# Altium schematic sheet Acorn_AudioHybrid.SchDoc: ARM2 to ARM3 Adapter
size A3; DocumentNumber: 1; SheetNumber: 1; SheetTotal: 1
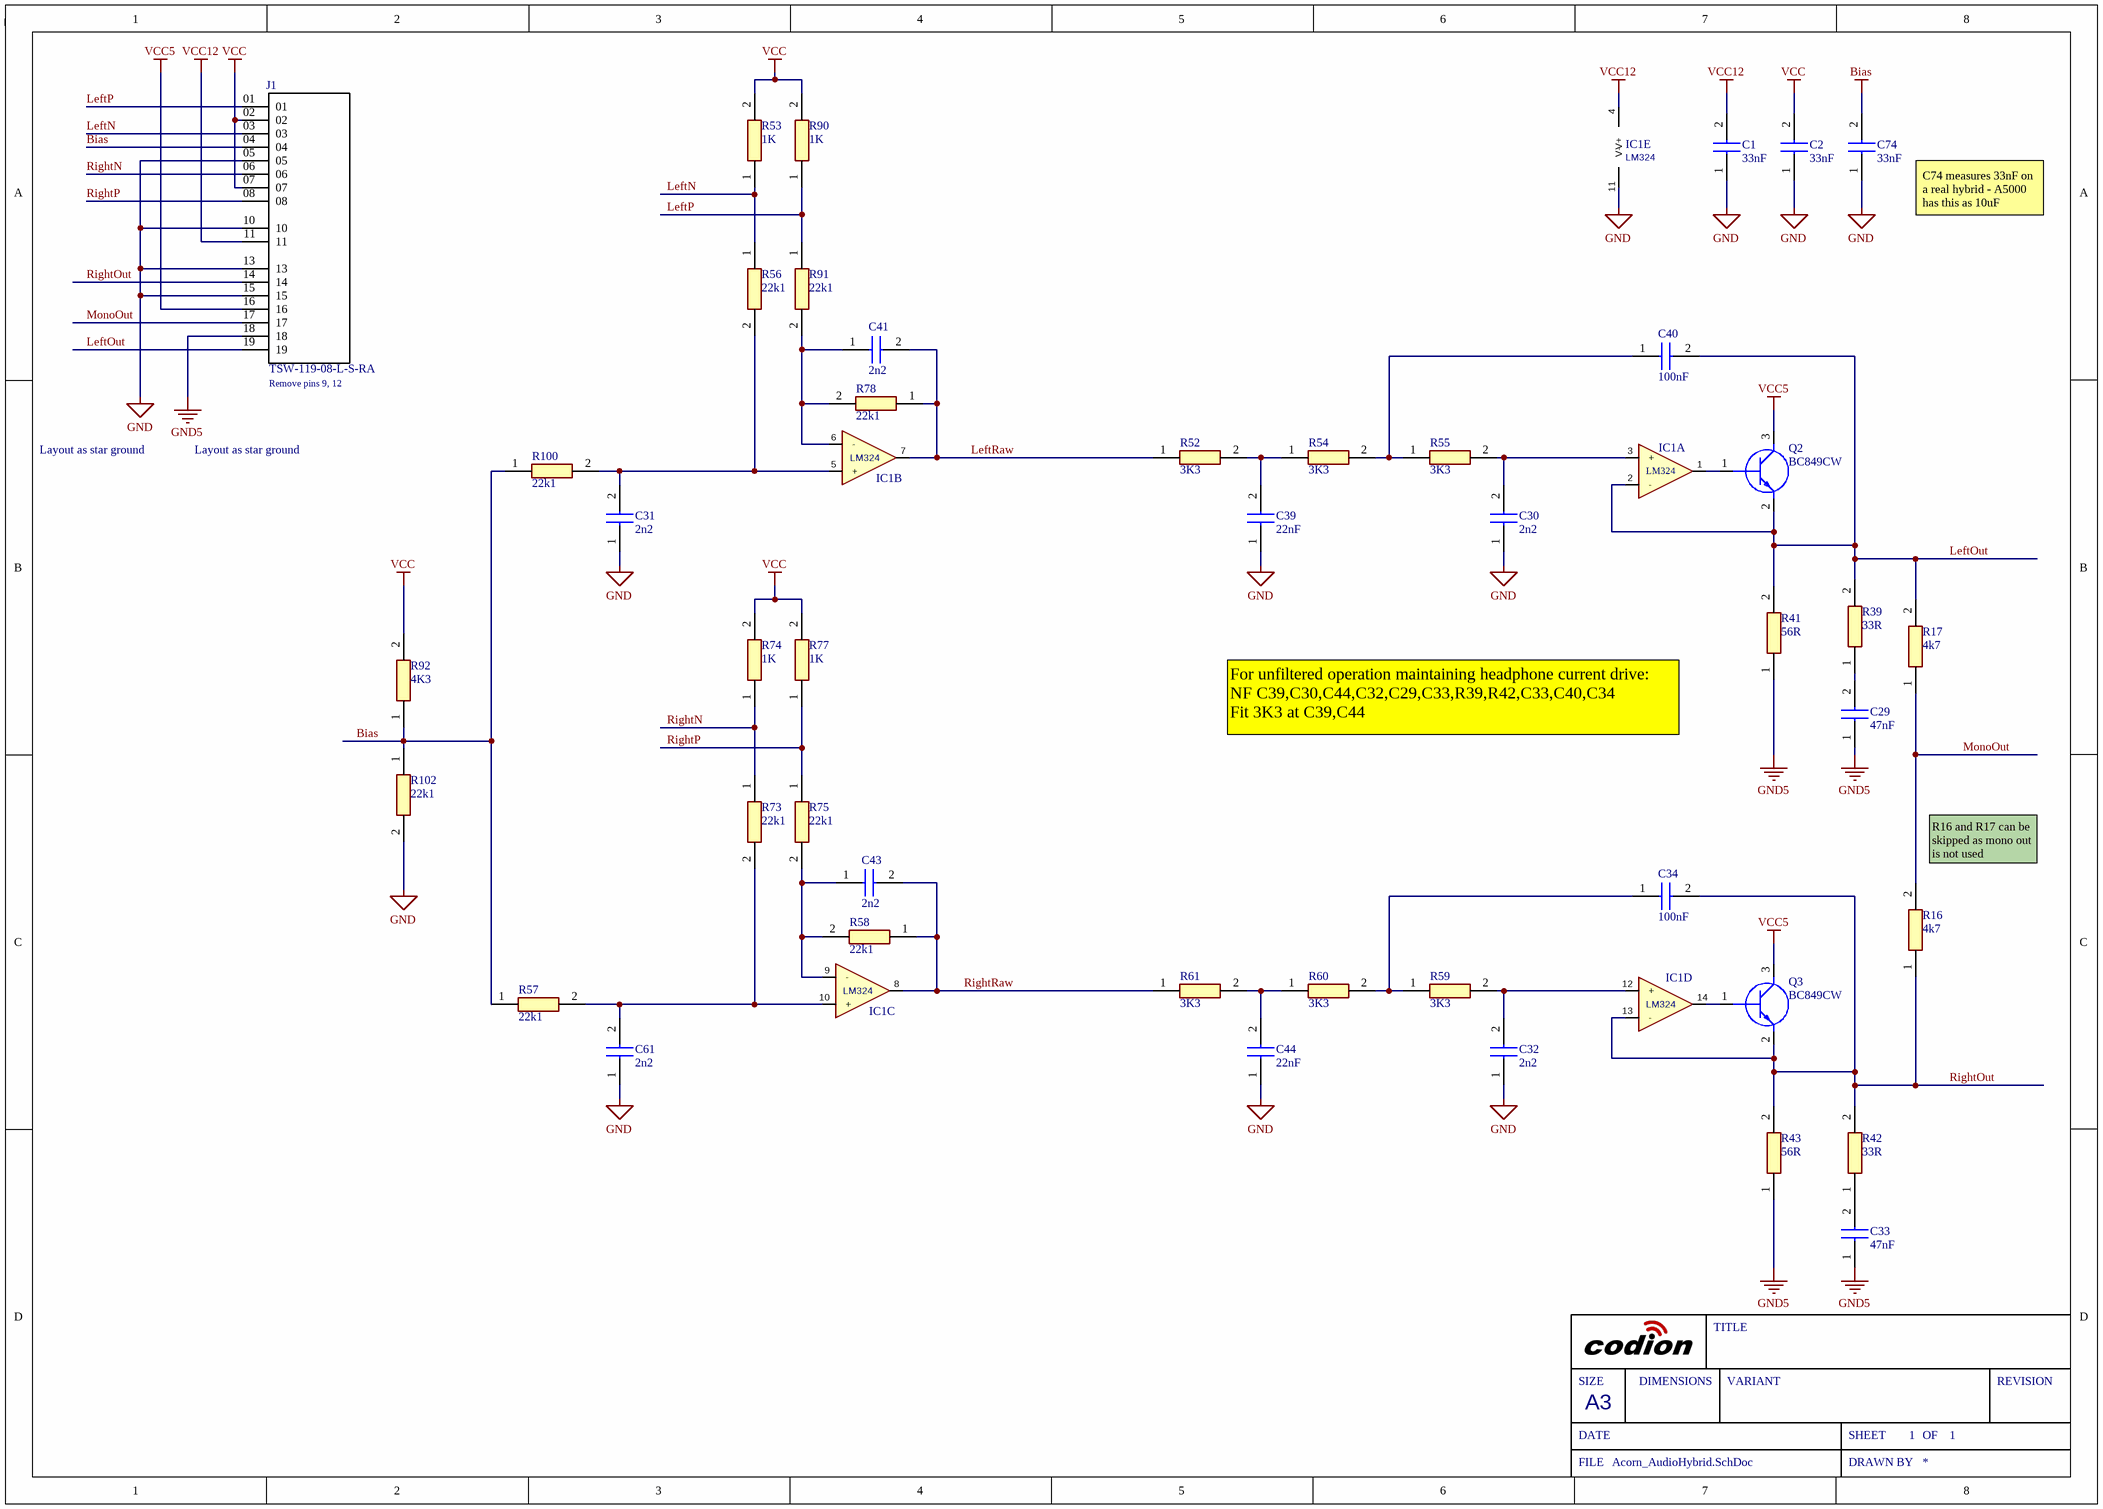
[diagram p0: Acorn_AudioHybrid.SchDoc]

## Parts
C1  33nF  [CAPC2012X145N]
C2  33nF  [CAPC2012X145N]
C29  47nF  [C0402C104J4RACTU]
C30  2n2  [CAPC1005X55N]
C31  2n2  [CAPC1005X55N]
C32  2n2  [CAPC1005X55N]
C33  47nF  [C0402C104J4RACTU]
C34  100nF  [CAPC1005X55N]
C39  22nF  [C0402]
C40  100nF  [CAPC1005X55N]
C41  2n2  [CAPC1005X55N]
C43  2n2  [CAPC1005X55N]
C44  22nF  [C0402]
C61  2n2  [CAPC1005X55N]
C74  33nF  [CAPC2012X145N]
IC1  value LM324  [SOIC127P600X180-14N]  (hidden comment: LM324M)  (parts A,B,C,D,E of 5)
J1  TSW-119-08-L-S-RA  [*SAMTEC_TSW-119-08-L-S-RA_TSW-119-08-L-S-RA(Primary)]
Q2  BC849CW  [SOT65P210X110-3N]
Q3  BC849CW  [SOT65P210X110-3N]
R16  4k7  [RESC1005X40N]
R17  4k7  [RESC1005X40N]
R39  33R  [RESC1005X40N]
R41  56R  [CRCW0402200KFKED]
R42  33R  [RESC1005X40N]
R43  56R  [CRCW0402200KFKED]
R52  3K3  [CRCW0402200KFKED]
R53  1K  [RESC1005X40N]
R54  3K3  [CRCW0402200KFKED]
R55  3K3  [CRCW0402200KFKED]
R56  22k1  [RESC1005X40N]
R57  22k1  [RESC1005X40N]
R58  22k1  [RESC1005X40N]
R59  3K3  [CRCW0402200KFKED]
R60  3K3  [CRCW0402200KFKED]
R61  3K3  [CRCW0402200KFKED]
R73  22k1  [RESC1005X40N]
R74  1K  [RESC1005X40N]
R75  22k1  [RESC1005X40N]
R77  1K  [RESC1005X40N]
R78  22k1  [RESC1005X40N]
R90  1K  [RESC1005X40N]
R91  22k1  [RESC1005X40N]
R92  4K3  [RESC1005X40N]
R100  22k1  [RESC1005X40N]
R102  22k1  [RESC1005X40N]

## Nets
Bias: C74.2 J1.04 R57.1 R92.1 R100.1 R102.1
GND: C1.1 C2.1 C30.1 C31.1 C32.1 C39.1 C44.1 C61.1 C74.1 IC1.11(V-) J1.05 J1.10 J1.13 J1.15 R102.2
GND5: C29.1 C33.1 J1.18 R41.1 R43.1
VCC: C2.2 J1.02 J1.07 R53.2 R74.2 R77.2 R90.2 R92.2
VCC5: J1.16 Q2.3(C) Q3.3(C)
VCC12: C1.2 IC1.4(V+) J1.11
LeftN: J1.03 R53.1 R56.1
LeftOut: C40.2 IC1.2(-) J1.19 Q2.2(E) R17.2 R39.2 R41.2
LeftP: J1.01 R90.1 R91.1
LeftRaw: C41.2 IC1.7 R52.1 R78.1
MonoOut: J1.17 R16.2 R17.1
RightN: J1.06 R73.1 R74.1
RightOut: C34.2 IC1.13(-) J1.14 Q3.2(E) R16.1 R42.2 R43.2
RightP: J1.08 R75.1 R77.1
RightRaw: C43.2 IC1.8 R58.1 R61.1
NetC29_2: C29.2 R39.1
NetC30_2: C30.2 IC1.3(+) R55.2
NetC31_2: C31.2 IC1.5(+) R56.2 R100.2
NetC32_2: C32.2 IC1.12(+) R59.2
NetC33_2: C33.2 R42.1
NetC34_1: C34.1 R59.1 R60.2
NetC39_2: C39.2 R52.2 R54.1
NetC40_1: C40.1 R54.2 R55.1
NetC41_1: C41.1 IC1.6(-) R78.2 R91.2
NetC43_1: C43.1 IC1.9(-) R58.2 R75.2
NetC44_2: C44.2 R60.1 R61.2
NetC61_2: C61.2 IC1.10(+) R57.2 R73.2
NetIC1_1: IC1.1 Q2.1(B)
NetIC1_14: IC1.14 Q3.1(B)

## Notes on the sheet
- C74 measures 33nF on a real hybrid - A5000 has this as 10uF
- Layout as star ground
- (near J1) Remove pins 9, 12
- For unfiltered operation maintaining headphone current drive:
  NF C39,C30,C44,C32,C29,C33,R39,R42,C33,C40,C34
  Fit 3K3 at C39,C44
- (near R16) R16 and R17 can be skipped as mono out is not used
- SIZE
- DIMENSIONS
- TITLE
- VARIANT
- REVISION
- DATE
- A3
- SHEET
- OF
- FILE
- DRAWN BY

## Library data of the parts
C1 C2 C74 = C2012C0G1H333J125AA: Capacitor; Manufacturer_Name: TDK; Datasheet Link: https://product.tdk.com/info/en/catalog/datasheets/mlcc_commercial_midvoltage_en.pdf; Height: 1.45mm; Manufacturer_Part_Number: C2012C0G1H333J125AA; Mouser Part Number: 810-C2012C0G1H333J; Mouser Price/Stock: https://www.mouser.co.uk/ProductDetail/TDK/C2012C0G1H333J125AA?qs=NRhsANhppD%252B9iusLcop9UA%3D%3D; Arrow Part Number: C2012C0G1H333J125AA; Arrow Price/Stock: https://www.arrow.com/en/products/c2012c0g1h333j125aa/tdk
C29 C33 = C0402C473K3RECTU: Capacitor; Manufacturer_Name: Yageo Group; Datasheet Link: https://content.kemet.com/datasheets/KEM_C1002_X7R_SMD.pdf; Height: 0.55mm; Manufacturer_Part_Number: C0402C473K3RECTU; Mouser Part Number: 80-C0402C473K3RECTU; Mouser Price/Stock: https://www.mouser.co.uk/ProductDetail/KEMET/C0402C473K3RECTU?qs=55YtniHzbhBsOkATuUUh6g%3D%3D
C30-C32 C41 C43 C61 = CGA2B3X7R1H223K050BB: Capacitor; Manufacturer_Name: TDK; Datasheet Link: http://docs-europe.electrocomponents.com/webdocs/14e9/0900766b814e9125.pdf; Height: 0.55mm; Manufacturer_Part_Number: CGA2B3X7R1H223K050BB; Mouser Part Number: 810-CGA2B3X7R1H223K; Mouser Price/Stock: https://www.mouser.co.uk/ProductDetail/TDK/CGA2B3X7R1H223K050BB?qs=NRhsANhppD8qn5SyO3ZPFg%3D%3D; Arrow Part Number: CGA2B3X7R1H223K050BB; Arrow Price/Stock: https://www.arrow.com/en/products/cga2b3x7r1h223k050bb/tdk?region=nac
C34 C40 = CL05B104KP5VPNC: Capacitor; Manufacturer_Name: SAMSUNG; Datasheet Link: https://product.samsungsem.com/mlcc/CL05B104KP5VPN.do; Height: 0.55mm; Manufacturer_Part_Number: CL05B104KP5VPNC; Mouser Part Number: 187-CL05B104KP5VPNC; Mouser Price/Stock: https://www.mouser.co.uk/ProductDetail/Samsung-Electro-Mechanics/CL05B104KP5VPNC?qs=gqBM4hNBiUXTv%252BkFO9q2pQ%3D%3D
C39 C44 = C0402C223K5REC7411: Capacitor; Manufacturer_Name: Yageo Group; Datasheet Link: https://content.kemet.com/datasheets/KEM_C1090_X7R_ESD.pdf; Height: 0.55mm; Manufacturer_Part_Number: C0402C223K5REC7411; Mouser Part Number: 80-C0402C223K5RECLR; Mouser Price/Stock: https://www.mouser.co.uk/ProductDetail/KEMET/C0402C223K5REC7411?qs=55YtniHzbhAnXT3aE9sn1g%3D%3D; Arrow Part Number: C0402C223K5REC7411; Arrow Price/Stock: null?region=nac
IC1 = LM324
J1 = TSW-119-08-L-S-RA: None; MF: Samtec Inc.; Package: None; Price: None; MP: TSW-119-08-L-S-RA; Availability: Unavailable; Value: *
Q2 Q3 = BC849CW: Transistor BJT NPN; Manufacturer_Name: Nexperia; Datasheet Link: https://assets.nexperia.com/documents/data-sheet/BC849W_850W.pdf; Height: 1.1mm; Manufacturer_Part_Number: BC849CW; Mouser Part Number: N/A; Mouser Price/Stock: https://www.mouser.com/Search/Refine.aspx?Keyword=N%2FA
R16 R17 R102 = CRCW04024K70FKED: Resistor; Manufacturer_Name: Vishay; Datasheet Link: http://www.vishay.com/docs/20035/dcrcwe3.pdf; Height: 0.4mm; Manufacturer_Part_Number: CRCW04024K70FKED; Mouser Part Number: 71-CRCW0402-4.7K-E3; Mouser Price/Stock: https://www.mouser.co.uk/ProductDetail/Vishay-Dale/CRCW04024K70FKED?qs=Jz%252BxJjKhzTxI08uguE%252B9mA%3D%3D; Arrow Part Number: CRCW04024K70FKED; Arrow Price/Stock: https://www.arrow.com/en/products/crcw04024k70fked/vishay?region=nac
R39 R42 = CRCW040233R0FKED: Resistor; Manufacturer_Name: Vishay; Datasheet Link: http://www.vishay.com/docs/20035/dcrcwe3.pdf; Height: 0.4mm; Manufacturer_Part_Number: CRCW040233R0FKED; Mouser Part Number: 71-CRCW0402-33-E3; Mouser Price/Stock: https://www.mouser.co.uk/ProductDetail/Vishay-Dale/CRCW040233R0FKED?qs=TNtMkGKFKOyo77UGFlXIJw%3D%3D; Arrow Part Number: CRCW040233R0FKED; Arrow Price/Stock: https://www.arrow.com/en/products/crcw040233r0fked/vishay; LCSC Part #: C137880
R41 R43 = CRCW040256R2FKED: Resistor; Manufacturer_Name: Vishay; Datasheet Link: http://www.vishay.com/docs/20035/dcrcwe3.pdf; Height: 0.4mm; Manufacturer_Part_Number: CRCW040256R2FKED; Mouser Part Number: 71-CRCW0402-56.2-E3; Mouser Price/Stock: https://www.mouser.com/Search/Refine.aspx?Keyword=71-CRCW0402-56.2-E3
R52 R54 R55 R59-R61 = CRCW04023K30FKED: Resistor; Manufacturer_Name: Vishay; Datasheet Link: http://www.vishay.com/docs/20035/dcrcwe3.pdf; Height: 0.4mm; Manufacturer_Part_Number: CRCW04023K30FKED; Mouser Part Number: 71-CRCW0402-3.3K-E3; Mouser Price/Stock: https://www.mouser.co.uk/ProductDetail/Vishay-Dale/CRCW04023K30FKED?qs=iv%252Be0Bc5VY2uvlCcTQHBWQ%3D%3D; Arrow Part Number: CRCW04023K30FKED; Arrow Price/Stock: https://www.arrow.com/en/products/crcw04023k30fked/vishay.html?utm_currency=USD&region=nac
R53 R74 R77 R90 = RC0402FR-7W1KL: Resistor; Manufacturer_Name: KEMET; Datasheet Link: http://www.yageo.com/documents/recent/PYu-RC0402_51_RoHS_L_6_r.pdf; Height: 0.4mm; Manufacturer_Part_Number: RC0402FR-7W1KL; Mouser Part Number: 603-RC0402FR-7W1KL; Mouser Price/Stock: https://www.mouser.co.uk/ProductDetail/Yageo/RC0402FR-7W1KL?qs=AQlKX63v8Rtb3IVppNQWPg%3D%3D; Arrow Part Number: RC0402FR-7W1KL; Arrow Price/Stock: https://www.arrow.com/en/products/rc0402fr-7w1kl/yageo
R56-R58 R73 R75 R78 R91 R100 = CRCW040222K1FKED: Resistor; Manufacturer_Name: Vishay; Datasheet Link: http://www.vishay.com/docs/20035/dcrcwe3.pdf; Height: 0.4mm; Manufacturer_Part_Number: CRCW040222K1FKED; Mouser Part Number: 71-CRCW0402-22.1K-E3; Mouser Price/Stock: https://www.mouser.co.uk/ProductDetail/Vishay-Dale/CRCW040222K1FKED?qs=oYI6rOI5zkv%2FV1tTZIsV7A%3D%3D; Arrow Part Number: CRCW040222K1FKED; Arrow Price/Stock: https://www.arrow.com/en/products/crcw040222k1fked/vishay
R92 = RC0402FR-0710KP: Resistor; Manufacturer_Name: KEMET; Datasheet Link: https://componentsearchengine.com/Datasheets/2/RC0402FR-0710KP.pdf; Height: 0.4mm; Manufacturer_Part_Number: RC0402FR-0710KP; Mouser Part Number: 603-RC0402FR-0710KP; Mouser Price/Stock: https://www.mouser.co.uk/ProductDetail/YAGEO/RC0402FR-0710KP?qs=oypCK0zG325Ov8hhvMZZMg%3D%3D; Arrow Part Number: RC0402FR-0710KP; Arrow Price/Stock: https://www.arrow.com/en/products/rc0402fr-0710kp/yageo?region=nac